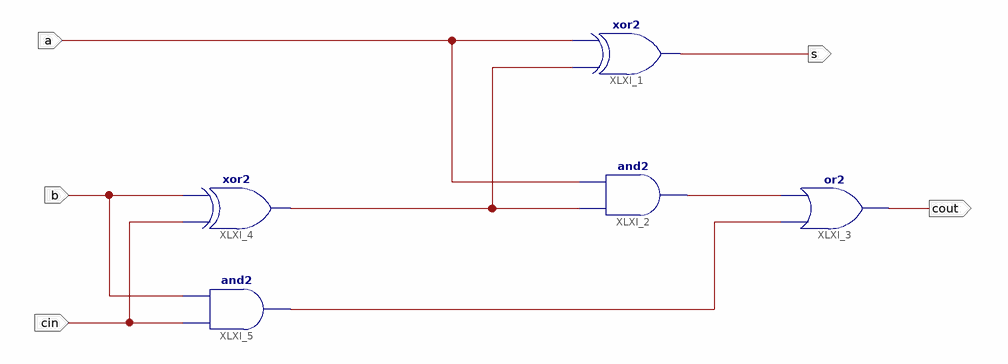
[diagram p0: schematic sheet 1]
// Xilinx ISE schematic lab1.sch (spartan3e) as structural Verilog: 5 symbols, 5 ports
module lab1 (
  input  a,
  input  cin,
  input  b,
  output s,
  output cout
);

  wire XLXN_4, XLXN_9, XLXN_11;

  xor XLXI_1 (s, XLXN_4, a);
  and XLXI_2 (XLXN_11, XLXN_4, a);
  or XLXI_3 (cout, XLXN_9, XLXN_11);
  xor XLXI_4 (XLXN_4, cin, b);
  and XLXI_5 (XLXN_9, cin, b);
endmodule
